# EAGLE design motherboard (EAGLE 5.10)
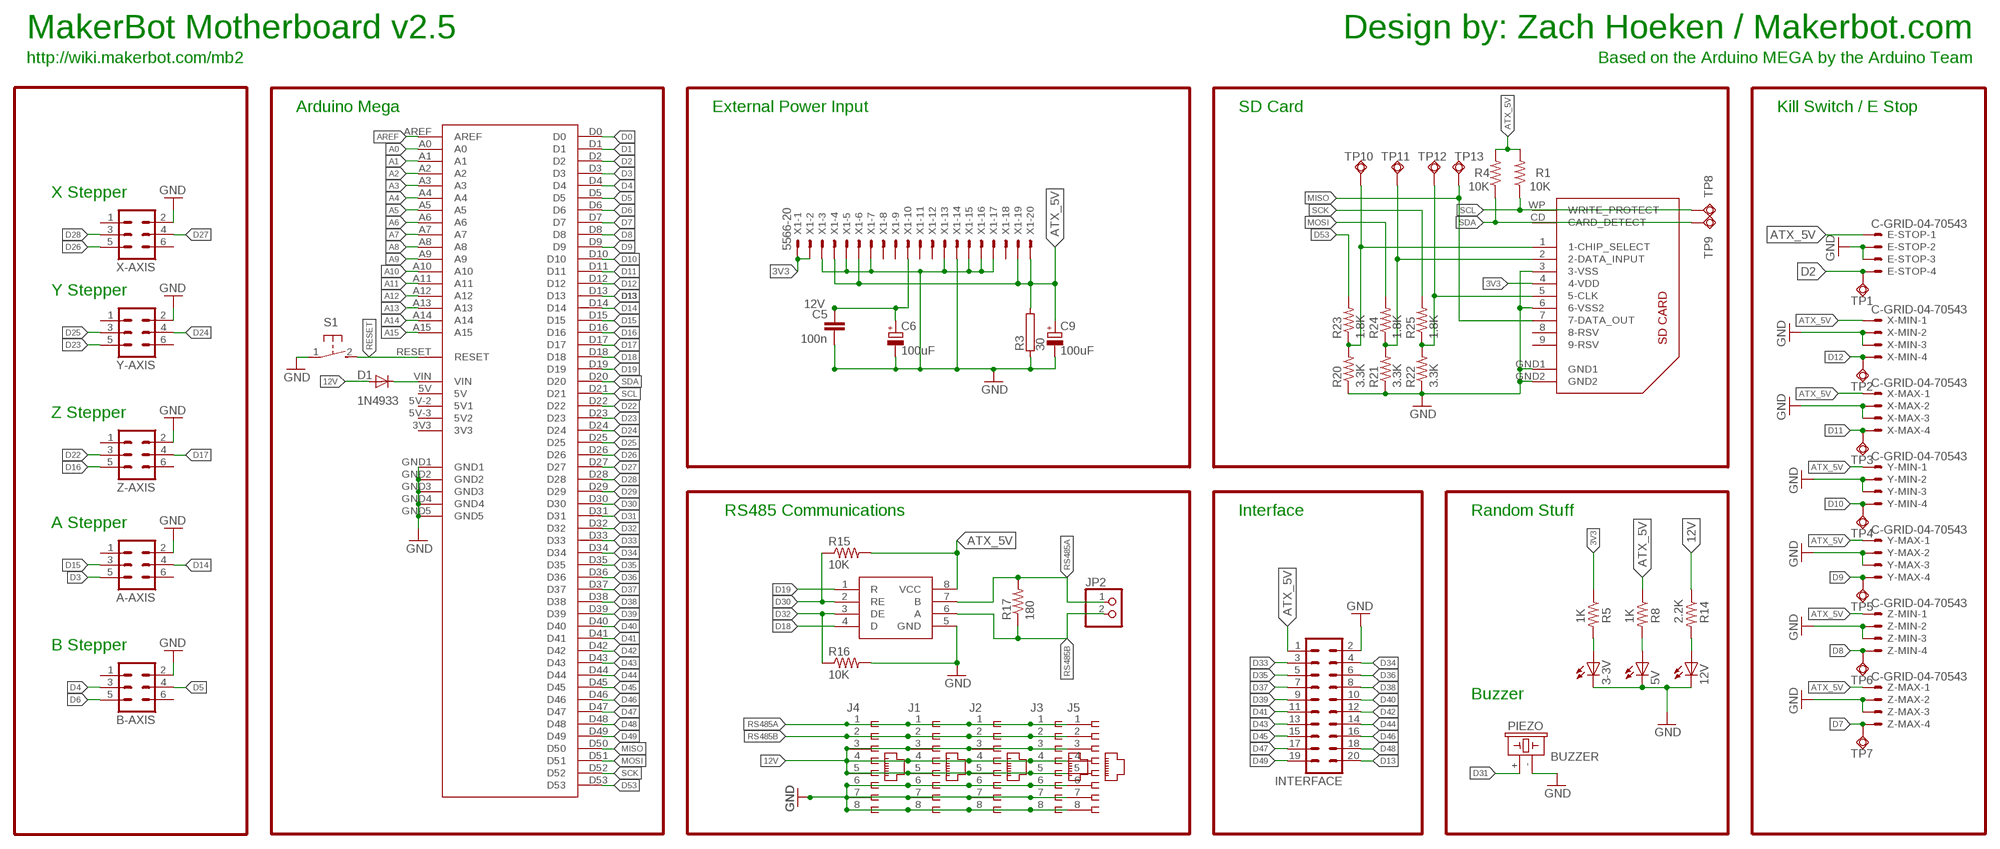
[diagram p0: schematic, sheet 1]

## Parts
3-3V  LED0805  [LED-0805]
5V  LED0805  [LED-0805]
12V  LED0805  [LED-0805]
A-AXIS  ML6  [ML6]
B-AXIS  ML6  [ML6]
C5  100n  CAP0805  [0805]
C6  100uF  CPOL-EUE3.5-8  [E3,5-8]
C9  100uF  CPOL-EUE3.5-8  [E3,5-8]
D1  1N4933  DIODEPTH  [DIODE-0.4]
E-STOP  C-GRID-04-70543  [70543-04]
IC1  SN75176ASOIC  [SO08]
INTERFACE  ML20  [ML20]
J1  556416-1  [556416-1]
J2  556416-1  [556416-1]
J3  556416-1  [556416-1]
J4  556416-1  [556416-1]
J5  556416-1  [556416-1]
JP2  PINHD-1X2  [1X02]
PIEZO  BUZZER  [BUZZER-12MM]
R1  10K  RESISTOR  [0805]
R3  30  RKH206-8  [KH206-8]
R4  10K  RESISTOR  [0805]
R5  1K  RESISTOR  [0805]
R8  1K  RESISTOR  [0805]
R14  2.2K  RESISTOR  [0805]
R15  10K  RESISTOR  [0805]
R16  10K  RESISTOR  [0805]
R17  180  RESISTOR  [0805]
R20  3.3K  RESISTOR  [0805]
R21  3.3K  RESISTOR  [0805]
R22  3.3K  RESISTOR  [0805]
R23  1.8K  RESISTOR  [0805]
R24  1.8K  RESISTOR  [0805]
R25  1.8K  RESISTOR  [0805]
S1  31-XX  [B3F-31XX]
TP1  TPSQTP09R  [TP09R]
TP2  TPSQTP09R  [TP09R]
TP3  TPSQTP09R  [TP09R]
TP4  TPSQTP09R  [TP09R]
TP5  TPSQTP09R  [TP09R]
TP6  TPSQTP09R  [TP09R]
TP7  TPSQTP09R  [TP09R]
TP8  TPSQTP09R  [TP09R]
TP9  TPSQTP09R  [TP09R]
TP10  TPSQTP09R  [TP09R]
TP11  TPSQTP09R  [TP09R]
TP12  TPSQTP09R  [TP09R]
TP13  TPSQTP09R  [TP09R]
U$1  ARDUINO-MEGA  [ARDUINO-MEGA]
U$2  SDCARD  [3M-SDCARD]
X1  5566-20  [5566-20]
X-AXIS  ML6  [ML6]
X-MAX  C-GRID-04-70543  [70543-04]
X-MIN  C-GRID-04-70543  [70543-04]
Y-AXIS  ML6  [ML6]
Y-MAX  C-GRID-04-70543  [70543-04]
Y-MIN  C-GRID-04-70543  [70543-04]
Z-AXIS  ML6  [ML6]
Z-MAX  C-GRID-04-70543  [70543-04]
Z-MIN  C-GRID-04-70543  [70543-04]

## Nets
3V3: R5.1 U$2.4(4-VDD) X1.1 X1.2
12V [power]: C5.1 C6.+ D1.A J1.3 J1.4 J1.5 J2.3 J2.4 J2.5 J3.3 J3.4 J3.5 J4.3 J4.4 J4.5 J5.3 J5.4 J5.5 R14.1 X1.10
A0: U$1.A0
A1: U$1.A1
A2: U$1.A2
A3: U$1.A3
A4: U$1.A4
A5: U$1.A5
A6: U$1.A6
A7: U$1.A7
A8: U$1.A8
A9: U$1.A9
A10: U$1.A10
A11: U$1.A11
A12: U$1.A12
A13: U$1.A13
A14: U$1.A14
A15: U$1.A15
AREF: U$1.AREF
ATX_5V [ATX_5V]: C9.+ E-STOP.1 IC1.8(VCC) INTERFACE.1 R1.2 R3.2 R4.2 R8.1 R15.2 X1.4 X1.6 X1.19 X1.20 X-MAX.1 X-MIN.1 Y-MAX.1 Y-MIN.1 Z-MAX.1 Z-MIN.1
D0: U$1.D0
D1: U$1.D1
D2: E-STOP.4 TP1.TP U$1.D2
D3: A-AXIS.5 U$1.D3
D4: B-AXIS.3 U$1.D4
D5: B-AXIS.4 U$1.D5
D6: B-AXIS.5 U$1.D6
D7: TP7.TP U$1.D7 Z-MAX.4
D8: TP6.TP U$1.D8 Z-MIN.4
D9: TP5.TP U$1.D9 Y-MAX.4
D10: TP4.TP U$1.D10 Y-MIN.4
D11: TP3.TP U$1.D11 X-MAX.4
D12: TP2.TP U$1.D12 X-MIN.4
D13: INTERFACE.20 U$1.D13
D14: A-AXIS.4 U$1.D14
D15: A-AXIS.3 U$1.D15
D16: U$1.D16 Z-AXIS.5
D17: U$1.D17 Z-AXIS.4
D18: IC1.4(D) U$1.D18
D19: IC1.1(R) U$1.D19
D22: U$1.D22 Z-AXIS.3
D23: U$1.D23 Y-AXIS.5
D24: U$1.D24 Y-AXIS.4
D25: U$1.D25 Y-AXIS.3
D26: U$1.D26 X-AXIS.5
D27: U$1.D27 X-AXIS.4
D28: U$1.D28 X-AXIS.3
D29: U$1.D29
D30: IC1.2(RE) R15.1 U$1.D30
D31: PIEZO.+ U$1.D31
D32: IC1.3(DE) R16.1 U$1.D32
D33: INTERFACE.3 U$1.D33
D34: INTERFACE.4 U$1.D34
D35: INTERFACE.5 U$1.D35
D36: INTERFACE.6 U$1.D36
D37: INTERFACE.7 U$1.D37
D38: INTERFACE.8 U$1.D38
D39: INTERFACE.9 U$1.D39
D40: INTERFACE.10 U$1.D40
D41: INTERFACE.11 U$1.D41
D42: INTERFACE.12 U$1.D42
D43: INTERFACE.13 U$1.D43
D44: INTERFACE.14 U$1.D44
D45: INTERFACE.15 U$1.D45
D46: INTERFACE.16 U$1.D46
D47: INTERFACE.17 U$1.D47
D48: INTERFACE.18 U$1.D48
D49: INTERFACE.19 U$1.D49
D53: R23.2 U$1.D53
GND [gnd]: 3-3V.C 5V.C 12V.C A-AXIS.2 B-AXIS.2 C5.2 C6.- C9.- E-STOP.2 E-STOP.3 IC1.5(GND) INTERFACE.2 J1.6 J1.7 J1.8 J2.6 J2.7 J2.8 J3.6 J3.7 J3.8 J4.6 J4.7 J4.8 J5.6 J5.7 J5.8 PIEZO.- R3.1 R16.2 R20.1 R21.1 R22.1 S1.1(P) U$1.GND1 U$1.GND2 U$1.GND3 U$1.GND4 U$1.GND5 U$2.3(3-VSS) U$2.6(6-VSS2) U$2.GND1 U$2.GND2 X1.3 X1.5 X1.7 X1.13 X1.14 X1.15 X1.16 X1.17 X-AXIS.2 X-MAX.2 X-MAX.3 X-MIN.2 X-MIN.3 Y-AXIS.2 Y-MAX.2 Y-MAX.3 Y-MIN.2 Y-MIN.3 Z-AXIS.2 Z-MAX.2 Z-MAX.3 Z-MIN.2 Z-MIN.3
MISO: TP13.TP U$1.D50 U$2.7(7-DATA_OUT)
MOSI: R24.2 U$1.D51
N$1: 3-3V.A R5.2
N$2: D1.C U$1.VIN
N$3: 5V.A R8.2
N$4: R22.2 R25.1 TP12.TP U$2.5(5-CLK)
N$5: R21.2 R24.1 TP11.TP U$2.2(2-DATA_INPUT)
N$10: 12V.A R14.2
N$11: R20.2 R23.1 TP10.TP U$2.1(1-CHIP_SELECT)
RESET: S1.2(S) U$1.RESET
RS485A: IC1.7(B) J1.1 J2.1 J3.1 J4.1 J5.1 JP2.1 R17.2
RS485B: IC1.6(A) J1.2 J2.2 J3.2 J4.2 J5.2 JP2.2 R17.1
SCK: R25.2 U$1.D52
SCL: R1.1 TP8.TP U$1.D21 U$2.WP(WRITE_PROTECT)
SDA: R4.1 TP9.TP U$1.D20 U$2.CD(CARD_DETECT)
Unconnected: A-AXIS.1 A-AXIS.6 B-AXIS.1 B-AXIS.6 U$1.3V3 U$1.5V U$1.5V-2(5V1) U$1.5V-3(5V2) U$2.8(8-RSV) U$2.9(9-RSV) X1.8 X1.9 X1.11 X1.12 X1.18 X-AXIS.1 X-AXIS.6 Y-AXIS.1 Y-AXIS.6 Z-AXIS.1 Z-AXIS.6

## Notes on the sheet
- Design by: Zach Hoeken / Makerbot.com
- MakerBot Motherboard v2.5
- Based on the Arduino MEGA by the Arduino Team
- http://wiki.makerbot.com/mb2
- Arduino Mega | External Power Input | SD Card | Kill Switch / E Stop
- X Stepper
- Y Stepper
- Z Stepper
- RS485 Communications | Interface | Random Stuff
- A Stepper
- B Stepper
- Buzzer

## Library data of the parts
3-3V 5V 12V = SparkFun:LED: LEDs Standard schematic elements and footprints for 5mm, 3mm, 1206, and 0603 sized LEDs. 5mm - Spark Fun Electronics SKU : COM-00529 (and others)
A-AXIS B-AXIS X-AXIS Y-AXIS Z-AXIS = con-ml:ML6: HARTING
C5 = SparkFun:CAP: Capacitor Standard 0603 ceramic capacitor, and 0.1" leaded capacitor.
C6 C9 = resistor:CPOL-EU: POLARIZED CAPACITOR, European symbol
D1 = SparkFunEagle-6-6-07:DIODE: Diode These are standard reverse protection diodes and small signal diodes. SMA package can handle up to about 1A. SOD-323 can handle about 200mA. What the SOD-323 package when ordering, there are some mfgs out there that are 5-pin packages.
E-STOP X-MAX X-MIN Y-MAX Y-MIN Z-MAX Z-MIN = con-molex:C-GRID-04: CONNECTOR wire to board 2.54 mm (0.100") pitch header
IC1 = reprap:SN75176A
INTERFACE = con-harting-ml:ML20: HARTING
J1-J5 = con-amp:556416-1: AMP connector
JP2 = pinhead:PINHD-1X2: PIN HEADER
PIEZO = SparkFunEagle-6-6-07:BUZZER: Buzzer 12mm Spark Fun Electronics SKU : Comp-Buzzer
R1 R4 R5 R8 R14-R17 R20-R25 = SparkFun:RESISTOR: Resistor Basic schematic elements and footprints for 0603, 1206, and PTH 1/10th watt (small) resistors.
R3 = resistor-power:R: Power Resitor
S1 = switch-omron:31-XX: OMRON SWITCH
TP1-TP13 = testpad:TPSQ: Test pad
U$1 = MakerBot:ARDUINO-MEGA
U$2 = reprap:SDCARD
X1 = con-molex:5566-20: Mini FIT connector 20 pol ATX PC-Motherboard Power connector Source: http://www.molex.com

## Net classes
0 default: width 0.254 mm, drill 0.406 mm, clearance 0.254 mm
1 power: width 1.27 mm, drill 0.711 mm, clearance 0.254 mm to class 0, clearance 0.254 mm
2 gnd: width 0.305 mm, drill 0.711 mm, clearance 0.254 mm to class 0, clearance 0.254 mm to class 1, clearance 0.254 mm
3 usbvcc: width 0.508 mm, drill 0.711 mm, clearance 0.254 mm to class 0, clearance 0.254 mm to class 1, clearance 0.254 mm to class 2, clearance 0.254 mm
4 ATX_5V: width 0.406 mm, drill 0.508 mm, clearance 0.254 mm to class 0, clearance 0.254 mm to class 1, clearance 0.254 mm to class 2, clearance 0.254 mm to class 3, clearance 0.254 mm

## Board
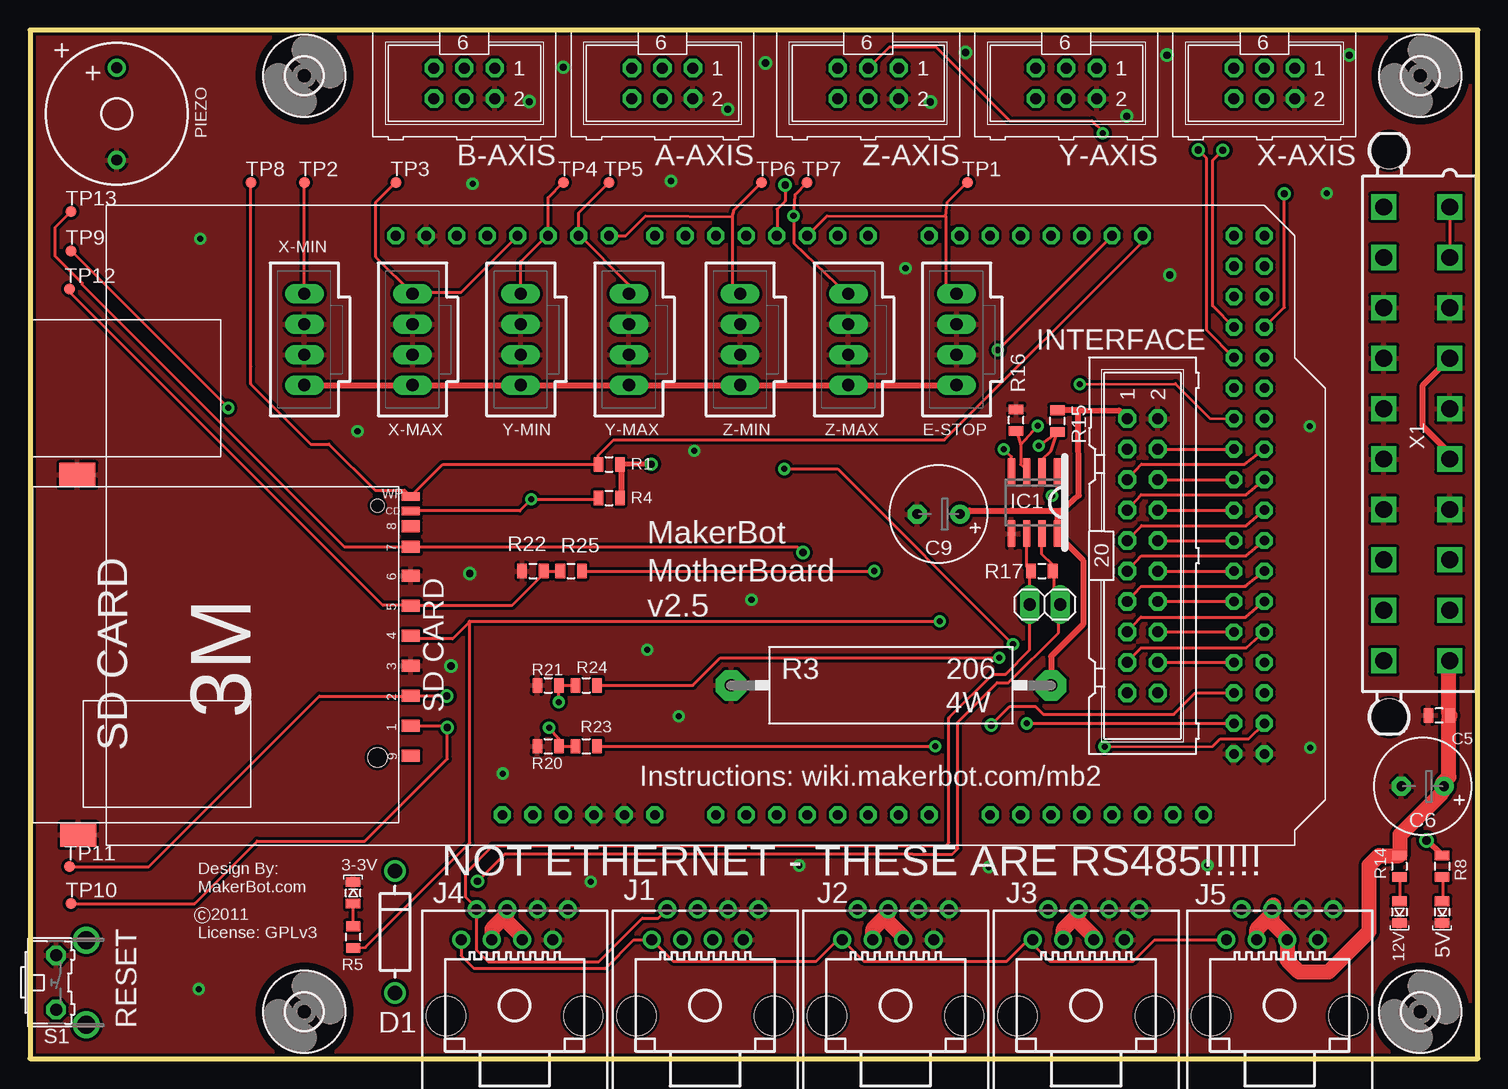
[diagram p1: board, top side]
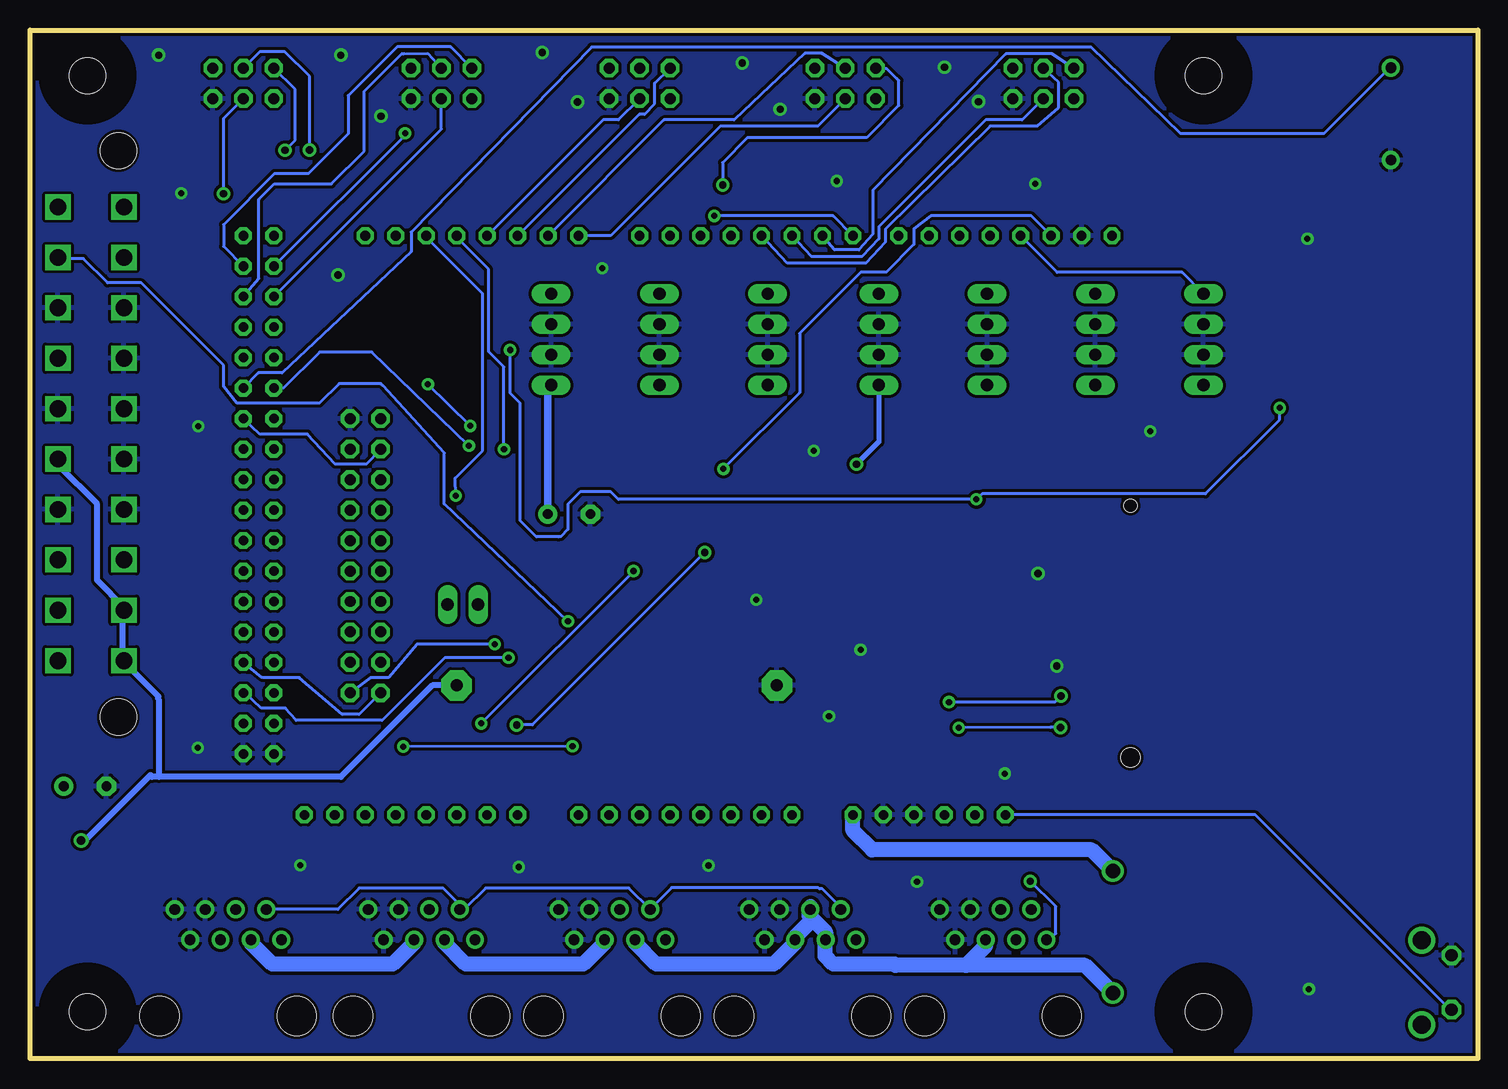
[diagram p2: board, bottom side, seen from below]

Size 120.65 x 85.72 mm. Coordinates in mm from the lower left corner, seen from the top.
Outline: 0,0 120.65,0 120.65,85.72 0,85.72 0,0
Copper layers (1*16): Top 0.035mm / dielectric 1.5mm / Bottom 0.035mm
Design rules "SparkFun": minimum track width 8mil, minimum drill 20mil, track to track 8mil, track to pad 8mil, pad to pad 8mil, via to via 8mil, smd to smd 8mil, copper to edge 10mil, drill to drill 8mil, minimum pad ring 12mil, minimum via ring 10mil, stop-mask expansion 4mil, vias tented up to drill 25mil, thermal gap 10mil

### Footprints (pad centres in the part's own frame; a part is rotated, then mirrored left to right if it is on the bottom)
LED-0805 = smd 1.2 x 0.8: A 0,-0.9; C 0,0.9
ML6 = drill 0.914 octagon: 1 -2.54,-1.27; 2 -2.54,1.27; 3 0,-1.27; 4 0,1.27; 5 2.54,-1.27; 6 2.54,1.27
0805 = smd 0.8 x 1.2: 1 -0.9,0; 2 0.9,0
E3,5-8 = drill 0.813 pad 1.6 round: + -1.778,0 | drill 0.813 pad 1.6 octagon: - 1.778,0
DIODE-0.4 = drill 1.2 round: A 0,0; C 10.16,0
70543-04 = drill 1.016 long: 1 -3.81,0; 2 -1.27,0; 3 1.27,0; 4 3.81,0
SO08 = smd 0.6 x 2.2: 1 -1.905,-2.6; 2 -0.635,-2.6; 3 0.635,-2.6; 4 1.905,-2.6; 5 1.905,2.6; 6 0.635,2.6; 7 -0.635,2.6; 8 -1.905,2.6
ML20 = drill 0.914 octagon: 1 -11.43,-1.27; 2 -11.43,1.27; 3 -8.89,-1.27; 4 -8.89,1.27; 5 -6.35,-1.27; 6 -6.35,1.27; 7 -3.81,-1.27; 8 -3.81,1.27; 9 -1.27,-1.27; 10 -1.27,1.27; 11 1.27,-1.27; 12 1.27,1.27; 13 3.81,-1.27; 14 3.81,1.27; 15 6.35,-1.27; 16 6.35,1.27; 17 8.89,-1.27; 18 8.89,1.27; 19 11.43,-1.27; 20 11.43,1.27
556416-1 = drill 0.889 round: 1 -4.445,5.461; 2 -3.175,8.001; 3 -1.905,5.461; 4 -0.635,8.001; 5 0.635,5.461; 6 1.905,8.001; 7 3.175,5.461; 8 4.445,8.001 | hole 3.251: -5.715,-0.889; 5.715,-0.889
1X02 = drill 1.016 long: 1 -1.27,0; 2 1.27,0
BUZZER-12MM = drill 0.9 round: + 3.85,0; - -3.85,0
KH206-8 = drill 1.016 pad 2.54 octagon: 1 -13.335,0; 2 13.335,0
B3F-31XX = drill 1.016 octagon: 1 -2.261,-1.245; 2 2.261,-1.245 | drill 1.499 pad 2.159 round: 3 -3.505,1.245; 4 3.505,1.245
TP09R = smd 0.9 x 0.9: TP 0,0
ARDUINO-MEGA = drill 0.8 octagon: 3V3 35.56,2.54; 5V 93.98,50.8; 5V-2 96.52,50.8; 5V-3 38.1,2.54; A0 50.8,2.54; A1 53.34,2.54; A2 55.88,2.54; A3 58.42,2.54; A4 60.96,2.54; A5 63.5,2.54; A6 66.04,2.54; A7 68.58,2.54; A8 73.66,2.54; A9 76.2,2.54; A10 78.74,2.54; A11 81.28,2.54; A12 83.82,2.54; A13 86.36,2.54; A14 88.9,2.54; A15 91.44,2.54; AREF 24.13,50.8; D0 63.5,50.8; D1 60.96,50.8; D2 58.42,50.8; D3 55.88,50.8; D4 53.34,50.8; D5 50.8,50.8; D6 48.26,50.8; D7 45.72,50.8; D8 41.91,50.8; D9 39.37,50.8; D10 36.83,50.8; D11 34.29,50.8; D12 31.75,50.8; D13 29.21,50.8; D14 68.58,50.8; D15 71.12,50.8; D16 73.66,50.8; D17 76.2,50.8; D18 78.74,50.8; D19 81.28,50.8; D20 83.82,50.8; D21 86.36,50.8; D22 93.98,48.26; D23 96.52,48.26; D24 93.98,45.72; D25 96.52,45.72; D26 93.98,43.18; D27 96.52,43.18; D28 93.98,40.64; D29 96.52,40.64; D30 93.98,38.1; D31 96.52,38.1; D32 93.98,35.56; D33 96.52,35.56; D34 93.98,33.02; D35 96.52,33.02; D36 93.98,30.48; D37 96.52,30.48; D38 93.98,27.94; D39 96.52,27.94; D40 93.98,25.4; D41 96.52,25.4; D42 93.98,22.86; D43 96.52,22.86; D44 93.98,20.32; D45 96.52,20.32; D46 93.98,17.78; D47 96.52,17.78; D48 93.98,15.24; D49 96.52,15.24; D50 93.98,12.7; D51 96.52,12.7; D52 93.98,10.16; D53 96.52,10.16; GND1 26.67,50.8; GND2 93.98,7.62; GND3 96.52,7.62; GND4 40.64,2.54; GND5 43.18,2.54; RESET 33.02,2.54; VIN 45.72,2.54
3M-SDCARD = smd 1 x 1.5: 1 5.93,16.5; 2 3.43,16.5; 3 0.93,16.5; 4 -1.57,16.5; 5 -4.07,16.5; 6 -6.57,16.5; 7 -9,16.5; 8 -10.7,16.5; 9 8.43,16.5 | smd 0.7 x 1.5: CD -12,16.5; WP -13.2,16.5 | smd 2 x 3: GND1 -15,-11.3; GND2 15,-11.2 | hole 1.1: -12.427,13.705 | hole 1.6: 8.567,13.708
3,0 = hole 3: 0,0
5566-20 = drill 1.4 square: 1 18.9,-2.75; 2 14.7,-2.75; 3 10.5,-2.75; 4 6.3,-2.75; 5 2.1,-2.75; 6 -2.1,-2.75; 7 -6.3,-2.75; 8 -10.5,-2.75; 9 -14.7,-2.75; 10 -18.9,-2.75; 11 18.9,2.75; 12 14.7,2.75; 13 10.5,2.75; 14 6.3,2.75; 15 2.1,2.75; 16 -2.1,2.75; 17 -6.3,2.75; 18 -10.5,2.75; 19 -14.7,2.75; 20 -18.9,2.75 | hole 3: 23.6,2.29; -23.6,2.29

### Placement (x,y rotation side)
3-3V  26.92,13.82 0 top
5V  117.68,12.22 180 top
12V  114.12,12.22 180 top
A-AXIS  52.7,81.28 180 top
B-AXIS  36.2,81.28 180 top
C5  117.43,28.6 180 top
C6  116.06,22.7 180 top
C9  75.72,45.38 180 top
D1  30.42,5.49 90 top
E-STOP  77.22,59.94 90 top
IC1  83.69,46.35 180 top
INTERFACE  92.71,41.91 270 top
J1  56.26,4.45 0 top
J2  72.14,4.45 0 top
J3  88.01,4.45 0 top
J4  40.39,4.45 0 top
J5  104.14,4.45 0 top
JP2  84.58,37.85 180 top
PIEZO  7.24,78.74 90 top
R1  48.26,49.53 0 top
R3  71.75,31.11 0 top
R4  48.26,46.73 0 top
R5  26.94,10.13 90 top
R8  117.68,16.03 270 top
R14  114.12,16.03 270 top
R15  85.61,53.14 90 top
R16  82.18,53.21 90 top
R17  84.33,40.64 0 top
R20  43.18,26.04 0 top
R21  43.18,31.11 0 top
R22  41.91,40.64 0 top
R23  46.36,26.04 0 top
R24  46.36,31.11 0 top
R25  45.09,40.64 0 top
S1  3.43,6.35 270 top
TP1  78.11,73.03 0 top
TP2  22.86,73.03 0 top
TP3  30.48,73.03 0 top
TP4  44.45,73.03 0 top
TP5  48.26,73.03 0 top
TP6  60.96,73.03 0 top
TP7  64.77,73.03 0 top
TP8  18.41,73.03 0 top
TP9  3.41,67.31 0 top
TP10  3.41,12.93 0 top
TP11  3.31,16 0 top
TP12  3.31,64.14 0 top
TP13  3.41,70.58 0 top
U$1  6.35,17.78 0 top
U$2  15.24,33.66 270 top
U$4  [3,0]  22.86,81.92 0 top
U$5  [3,0]  115.86,81.92 0 top
U$6  [3,0]  115.86,3.92 0 top
U$7  [3,0]  22.86,3.92 0 top
X1  115.57,52.07 90 top
X-AXIS  102.87,81.28 180 top
X-MAX  31.88,59.94 90 top
X-MIN  22.86,59.94 90 top
Y-AXIS  86.36,81.28 180 top
Y-MAX  49.91,59.94 90 top
Y-MIN  40.89,59.94 90 top
Z-AXIS  69.85,81.28 180 top
Z-MAX  68.2,59.94 90 top
Z-MIN  59.18,59.94 90 top

### Tracks (layer width: path | path; a pad name or v marks a point on that pad's centre or on a via)
3V3  (via drill 0.51)
  Top 0.254: X1.2 118.36,66.8 118.36,70.87 X1.1 | R5.1 27.94,9.27 36.65,17.98 36.65,36.45 | 36.65,36.45 v75.82,36.45 | 36.65,36.45 36.59,36.45 36.59,36.36 35.22,34.99 31.98,34.99 U$2.4
  Bottom 0.254: v75.82,36.45 86.13,46.23 86.12,50.48 91.21,56.07 91.41,56.26 94.89,56.26 96.53,54.62 103.4,54.62 104.52,56.01 104.52,57.78 111.38,64.64 114.17,64.64 116.2,66.67 118.24,66.67 X1.2
12V
  Top 1.27: X1.10 118.24,33.15 118.24,28.7 C5.1 118.24,28.32 118.24,23.5 117.73,22.99 C6.+ 117.73,22.61 117.73,22.23 114.17,18.67 114.17,17.02 R14.1 112.4,16.93 111.59,16.13 111.59,10.6 108.22,7.23 105.74,7.23 104.76,8.2 104.76,10.12 103.48,11.4 103.48,12.68 103.63,12.83 103.63,12.7 J5.4 103.5,12.06 103.19,11.75 | J5.3 102.23,10.79 103.19,11.75 | J5.5 104.77,10.16 103.19,11.75 | J3.3 86.11,10.79 87.06,11.75 | 87.06,11.75 87.38,12.06 J3.4 | J3.5 88.65,10.16 87.06,11.75 | J2.3 70.23,10.79 71.18,11.75 | 71.18,11.75 71.5,12.06 J2.4 | J2.5 72.77,10.16 71.18,11.75 | J4.3 38.48,10.79 39.43,11.75 | 39.43,11.75 39.75,12.06 J4.4 | J4.5 41.02,10.16 39.43,11.75
  Bottom 1.27: J1.4 55.63,12.7 | J1.3 54.36,10.54 55.44,11.62 | 55.44,11.62 55.75,11.94 55.75,12.19 J1.4 | 55.44,11.62 56.9,10.16 J1.5 56.9,9.65 58.67,7.87 68.45,7.87 70.23,9.65 J2.3 | J3.3 86.11,9.65 84.33,7.87 74.55,7.87 72.77,9.65 J2.5 | J5.3 102.23,9.65 100.46,7.87 90.42,7.87 88.65,9.65 J3.5 | J1.4 55.63,11.82 54.38,10.58 54.38,8.57 53.7,7.89 48.62,7.89 48.51,7.79 42.65,7.79 | 42.65,7.79 41.02,9.41 J4.5 | D1.A 32.72,7.79 42.65,7.79
ATX_5V  (via drill 0.6 pad 1.02, 0.71)
  Top 0.406: v51.78,49.54 49.39,49.54 49.28,49.53
  Top 0.508: X1.6 118.24,50.04 118.24,50.55 116.08,52.7 116.08,56.13 118.24,58.29 X1.4 | v116.38,18.19 117.6,17.02 R8.1 | X-MIN.1 X-MAX.1 Y-MIN.1 Y-MAX.1 Z-MIN.1 Z-MAX.1 E-STOP.1 | R4.2 49.28,46.74 49.28,49.53 R1.2 49.28,49.66 | 87.34,54.03 90.77,54.01 INTERFACE.1 | 87.34,54.03 85.43,54.03 R15.2 | 85.61,45.33 87.41,46.95 87.34,54.03 | 85.61,45.33 IC1.8 85.72,43.56 87.76,41.53 87.76,36.2 85.09,33.53 R3.2 | 85.61,45.33 86.02,45.67 81.75,45.68 78.3,45.68 78,45.38 C9.+ 77.34,45.54
  Bottom 0.406: v51.78,49.54 49.91,51.41 Y-MAX.1
  Bottom 0.508: v116.38,18.19 116.2,18.03 110.62,23.62 110.49,23.5 109.88,23.5 | X1.6 118.24,49.91 118.24,49.4 115.06,46.23 115.06,39.88 112.78,37.59 X1.19 112.9,37.34 112.9,33.4 X1.20 112.9,33.15 109.96,30.2 109.96,29.97 109.88,29.9 109.88,23.5 | 109.88,23.5 94.74,23.5 87.12,31.11 R3.2 | E-STOP.1 77.5,55.85
  Bottom 0.61: 77.5,55.85 C9.+
D2
  Top 0.254: TP1.TP 76.45,71.37 76.3,70.22 | 76.3,70.22 76.3,64.5 E-STOP.4 | U$1.D2 66.42,70.23 76.3,70.22
D3  (via drill 0.6 pad 1.02)
  Top 0.254: U$1.D3 62.25,68.61 62.25,70.79 62.93,71.46 v62.93,72.81
  Bottom 0.254: v62.93,72.81 62.93,74.68 60.86,76.75 50.93,76.75 48.23,79.44 48.23,81.5 48.41,81.67 48.44,81.67 49.26,82.5 50.11,82.5 A-AXIS.5
D4
  Bottom 0.254: U$1.D4 57.54,66.31 50.99,66.31 49.38,68.05 49.38,69.13 40.64,77.72 36.73,77.72 34.94,79.25 34.94,81.37 B-AXIS.3
D5
  Bottom 0.254: U$1.D5 55.51,66.84 51.32,66.84 49.91,68.33 49.91,69.34 41.02,78.23 37.97,78.23 B-AXIS.4
D6
  Bottom 0.254: U$1.D6 53.62,67.4 51.59,67.4 50.42,68.71 50.42,72.39 39.33,83.74 35.48,83.74 B-AXIS.5
D7  (via drill 0.51)
  Top 0.254: TP7.TP 63.75,72.01 63.65,70.13 | 63.65,70.13 63.65,67.97 68.07,63.75 Z-MAX.4 | v63.63,70.23 63.65,70.13
  Bottom 0.254: U$1.D7 53.72,70.23 v63.63,70.23
D8
  Top 0.254: TP6.TP 58.67,70.74 58.52,70.18 | 58.52,70.18 58.52,64.21 Z-MIN.4 | U$1.D8 49.66,68.58 51.31,70.23 58.52,70.18
D9
  Top 0.254: TP5.TP 45.72,70.48 45.72,68.71 | Y-MAX.4 49.91,64.52 45.72,68.71 | 45.72,68.71 U$1.D9
D10
  Top 0.254: TP4.TP 43.18,71.75 43.18,68.71 | Y-MIN.4 40.89,66.42 43.18,68.71 | 43.18,68.71 U$1.D10
D11
  Top 0.254: TP3.TP 28.83,71.37 28.83,66.8 X-MAX.4 31.88,63.88 35.94,63.88 U$1.D11
D12
  Top 0.254: X-MIN.4 TP2.TP
  Bottom 0.254: U$1.D12 35.05,65.53 24.64,65.53 X-MIN.4
D13  (via drill 0.51)
  Top 0.254: v62.86,49.15 67.31,49.15 v81.92,34.54
  Bottom 0.254: U$1.D13 37.21,70.23 45.59,70.23 46.99,69.18 46.99,67.87 49.29,65.55 51.44,65.53 56.52,60.45 56.52,55.5 v62.86,49.15 | v81.92,34.54 88.39,34.54 90.77,31.75 92.29,31.75 INTERFACE.20
D14
  Bottom 0.254: U$1.D14 72.26,68.58 63.12,77.72 54.99,77.72 A-AXIS.4
D15
  Bottom 0.254: U$1.D15 67.82,78.23 61.98,78.23 56.07,83.78 54.67,83.78 A-AXIS.3
D16
  Bottom 0.254: U$1.D16 69.88,78.7 69.43,78.7 68.59,79.59 68.59,81.29 Z-AXIS.5
D17
  Bottom 0.254: U$1.D17 72.9,78.23 71.63,78.23 Z-AXIS.4
D18  (via drill 0.51)
  Top 0.254: v81.15,50.8 81.79,50.16 IC1.4
  Bottom 0.254: v81.15,50.8 81.15,57.66 82.42,58.93 82.42,65.79 85.09,68.45 U$1.D18
D19  (via drill 0.51)
  Top 0.254: v85.17,46.9 85.6,47.5 IC1.1
  Bottom 0.254: v85.17,46.9 85.22,48.39 82.93,50.67 82.93,63.75 87.63,68.45 U$1.D19
D22  (via drill 0.51)
  Top 0.254: Z-AXIS.3 71.63,84.33 75.48,84.33 81.64,78.17 88.49,78.17 89.39,77.27 v89.39,77.13
  Bottom 0.254: U$1.D22 89.39,76.97 v89.39,77.13
D23
  Bottom 0.254: U$1.D23 104.52,67.69 104.52,69.51 100.28,73.75 97.46,73.75 94.13,77.08 94.13,80.25 90.06,84.33 85.6,84.33 Y-AXIS.5
D24
  Bottom 0.254: U$1.D24 86.36,77.47 Y-AXIS.4
D25
  Bottom 0.254: U$1.D25 101.58,65 101.58,71.6 100.28,72.9 95.53,72.9 95.53,72.91 92.81,75.63 92.81,80.61 89.66,83.76 89.48,83.76 87.52,83.77 Y-AXIS.3
D26  (via drill 0.6 pad 1.02)
  Top 0.254: U$1.D26 98.55,62.74 98.55,74.85 v99.4,75.7
  Bottom 0.254: v99.4,75.7 98.56,76.54 98.56,80.78 X-AXIS.5
D27  (via drill 0.6 pad 1.02)
  Top 0.254: U$1.D27 104.52,62.61 v104.52,72.08
  Bottom 0.254: v104.52,72.08 104.52,78.36 X-AXIS.4
D28  (via drill 0.6 pad 1.02)
  Top 0.254: U$1.D28 98.04,60.71 98.04,75.03 v97.36,75.72
  Bottom 0.254: X-AXIS.3 101.5,83.92 99.43,83.92 97.36,81.85 v97.36,75.72
D30  (via drill 0.51)
  Top 0.254: IC1.2 84.33,49.91 85.09,50.67 R15.1 85.09,51.82 v84.07,51.07
  Bottom 0.254: U$1.D30 99.53,55.88 96.52,58.89 92.16,58.89 v84.07,51.07
D31
  Bottom 0.254: U$1.D31 101.62,57.15 99.63,57.15 88.9,67.25 88.9,68.87 73.84,84.3 52.58,84.3 51.18,84.3 32.23,84.3 24.77,77.09 12.83,77.09 7.24,82.68 PIEZO.+
D32  (via drill 0.51)
  Top 0.254: 82.55,51.18 82.55,49.53 83.06,49.02 IC1.3 | R16.1 82.55,51.18 | U$1.D32 98.31,53.39 95.45,56.26 v87.49,56.21 | 82.55,51.18 v83.97,52.73
  Bottom 0.254: v83.97,52.73 v87.49,56.21
D33
  Bottom 0.254: U$1.D33 101.49,52.05 97.54,52.05 95.22,49.54 92.62,49.54 INTERFACE.3
D34
  Top 0.254: INTERFACE.4 U$1.D34
D35
  Top 0.254: U$1.D35 101.23,49.54 92.62,49.54 INTERFACE.5
D36
  Top 0.254: INTERFACE.6 U$1.D36
D37
  Top 0.254: U$1.D37 101.35,47 92.6,47 INTERFACE.7
D38
  Top 0.254: INTERFACE.8 U$1.D38
D39
  Top 0.254: U$1.D39 101.35,44.42 92.63,44.42 INTERFACE.9
D40
  Top 0.254: INTERFACE.10 U$1.D40
D41
  Top 0.254: U$1.D41 101.35,41.91 92.61,41.91 INTERFACE.11
D42
  Top 0.254: INTERFACE.12 U$1.D42
D43
  Top 0.254: U$1.D43 101.28,39.36 92.6,39.36 INTERFACE.13
D44
  Top 0.254: INTERFACE.14 U$1.D44
D45
  Top 0.254: U$1.D45 101.33,36.8 92.58,36.8 INTERFACE.15
D46
  Top 0.254: INTERFACE.16 U$1.D46
D47
  Top 0.254: U$1.D47 101.35,34.24 92.6,34.24 INTERFACE.17
D48
  Top 0.254: INTERFACE.18 U$1.D48
D49
  Bottom 0.254: U$1.D49 101.3,31.75 98.2,31.75 94.61,28.7 93.22,28.7 INTERFACE.19
D53  (via drill 0.51)
  Top 0.254: v89.55,26.01 98.55,26.04 99.2,26.66 101.55,26.66 102.79,27.88 U$1.D53 | R23.2 v75.44,26.04
  Bottom 0.254: v75.44,26.04 v89.55,26.01
GND  (via drill 0.51, 0.51 pad 1.02, 0.6 pad 1.02)
  other vias: 51.44,34.07 60.12,38.25 55.35,50.66 27.29,52.3 54.06,28.54 39.41,23.76 14.07,5.8 46.74,14.76 64.11,16.1 79.91,15.98 98.12,16.12 106.68,25.91 106.64,52.69 108.05,72.11 53.42,73.14 72.96,65.87 36.88,72.92 14.2,68.33 44.44,82.63 61.29,82.97 77.97,83.85 94.74,83.63 109.93,83.63 41.61,79.76 58.14,79.12 75.03,79.72 91.4,78.55 94.98,65.3 36.65,40.44 35.09,32.73
  pour Top: -1.27,86.36 120.65,86.36 120.65,0 -1.27,0
  pour Bottom: -1.27,86.36 120.65,86.36 120.65,0 -1.27,0
MISO  (via drill 0.6 pad 1.02)
  Top 0.254: TP13.TP 2.1,69.28 2.1,66.89 4.36,64.63 4.36,64.49 26.18,42.67 31.72,42.67 U$2.7 63.95,42.66 v64.41,42.19 | U$1.D50 97.1,30.48 95.33,28.7 84.44,28.7 83.78,29.36 81.65,29.36 v80.1,27.81
  Bottom 0.254: v80.1,27.81 78.79,27.81 v64.41,42.19
MOSI  (via drill 0.51)
  Top 0.254: v80.77,33.4 57.53,33.4 55.25,31.11 R24.2
  Bottom 0.254: v80.77,33.4 86.11,33.4 91.31,28.19 98.48,28.19 99.38,29.21 101.36,29.21 102.74,30.48 U$1.D51
N$1
  Top 0.254: R5.2 3-3V.A
N$2
  Bottom 1.27: D1.C 32.18,17.41 50.48,17.41 52.07,19 U$1.VIN
N$3
  Top 0.254: 5V.A 117.73,13.21 117.73,15.11 R8.2
N$4
  Top 0.254: R25.1 R22.2 42.81,40.4 40.18,37.77 31.79,37.77 U$2.5 31.7,37.77 29.4,37.77 3.31,63.87 TP12.TP
N$5  (via drill 0.51, 0.6 pad 1.02)
  Top 0.254: R24.1 R21.2 44.07,31.11 v44.07,29.72 | TP11.TP 9.91,16 24.12,30.21 31.73,30.21 U$2.2 v34.73,30.23 34.8,30.23 34.77,30.2 34.75,30.23
  Bottom 0.254: v44.07,29.72 35.24,29.72 v34.73,30.23
N$10
  Top 0.254: 12V.A 114.17,13.21 114.17,15.11 R14.2
N$11  (via drill 0.51, 0.6 pad 1.02)
  Top 0.254: R23.1 R20.2 44.07,26.04 44.07,26.67 v43.26,27.58 | U$2.1 31.78,27.69 34.68,27.69 v34.77,27.6 34.77,24.99 27.91,18.14 18.92,18.14 13.72,12.93 TP10.TP
  Bottom 0.254: v43.26,27.58 v43.25,27.58 35.61,27.62 34.75,27.62 v34.77,27.6
RESET
  Bottom 0.254: U$1.RESET 18.54,20.32 2.29,4.06 S1.2
RS485A  (via drill 0.6 pad 1.02)
  Top 0.254: IC1.7 84.33,42.04 85.22,41.15 85.22,40.64 R17.2 85.34,40.64 85.34,38.35 JP2.1 85.72,37.85 85.72,35.51 81.53,31.33 80.59,31.33 78.36,29.08 77.32,28.04 77.32,17.51 76.86,17.06 73.55,17.06 73.53,17.07 39.6,17.07 39.06,16.54 v37.3,14.78 | 83.19,9.91 81.41,8.13 69.47,8.13 J2.1 67.69,9.78 67.18,9.78 65.53,8.13 53.59,8.13 J1.1 50.33,9.91 47.98,7.56 36.97,7.56 35.93,8.6 35.93,9.89 J4.1 | J5.1 93.73,9.91 91.95,8.13 84.96,8.13 83.19,9.91 | 83.19,9.91 J3.1
  Bottom 0.254: v37.3,14.78 35.17,12.7 35.17,10.45 35.71,9.91 J4.1
RS485B
  Top 0.254: IC1.6 83.06,41.02 R17.1 83.31,40.64 JP2.2 83.31,34.07 81.29,32.05 80.21,32.05 76.68,28.52 76.68,28.51 76.58,28.41 76.58,18.01 76.3,17.73 38.56,17.73 36.3,15.47 36.3,13.46 37.21,12.55 J4.2 37.21,9.05 38.18,8.09 47.41,8.09 51.04,11.72 52.36,11.72 J1.2
  Bottom 0.254: J2.2 70.74,14.22 82.68,14.22 84.45,12.45 | J5.2 95,12.45 93.22,14.22 86.23,14.22 84.45,12.45 | 84.45,12.45 J3.2 | J2.2 68.92,12.45 | J2.2 67.2,14.21 67.2,14.26 54.97,14.26 54.86,14.16 54.62,14.16 53,12.54 J1.2
SCK  (via drill 0.51)
  Top 0.254: v83.06,27.94 U$1.D52 | R25.2 v70.36,40.64
  Bottom 0.254: v70.36,40.64 v83.06,27.94
SCL
  Top 0.254: TP8.TP 18.41,57.68 18.4,57.67 18.4,56.21 23.39,51.22 24.91,51.22 28.75,47.37 31.22,47.37 U$2.WP 34.41,49.53 R1.1 47.37,49.53 47.37,50.29 48.64,51.56 76.2,51.56 92.71,68.07 U$1.D21
SDA  (via drill 0.51)
  Top 0.254: v16.51,54.23 3.43,67.31 TP9.TP | R4.1 47.24,46.61 v41.78,46.61 40.83,45.66 U$2.CD | v80.64,59.05 U$1.D20
  Bottom 0.254: v16.51,54.23 16.51,53.26 22.7,47.08 41.31,47.08 v41.78,46.61 71.63,46.61 72.25,47.23 74.8,47.23 75.82,46.22 75.82,44.11 76.42,43.51 76.58,43.51 76.61,43.48 78.46,43.48 79.81,44.83 79.81,54.63 80.64,55.47 v80.64,59.05

### Text on the board
tPlace: PIEZO | MakerBot | MotherBoard | v2.5 | SD CARD | Instructions: wiki.makerbot.com/mb2 | Design By: | NOT ETHERNET - THESE ARE RS485!!!!! | MakerBot.com | c 2011 | License: GPLv3 | RESET | D1
_tsilk: +